# EAGLE schematic pcb_switch_switch (EAGLE 6.2)
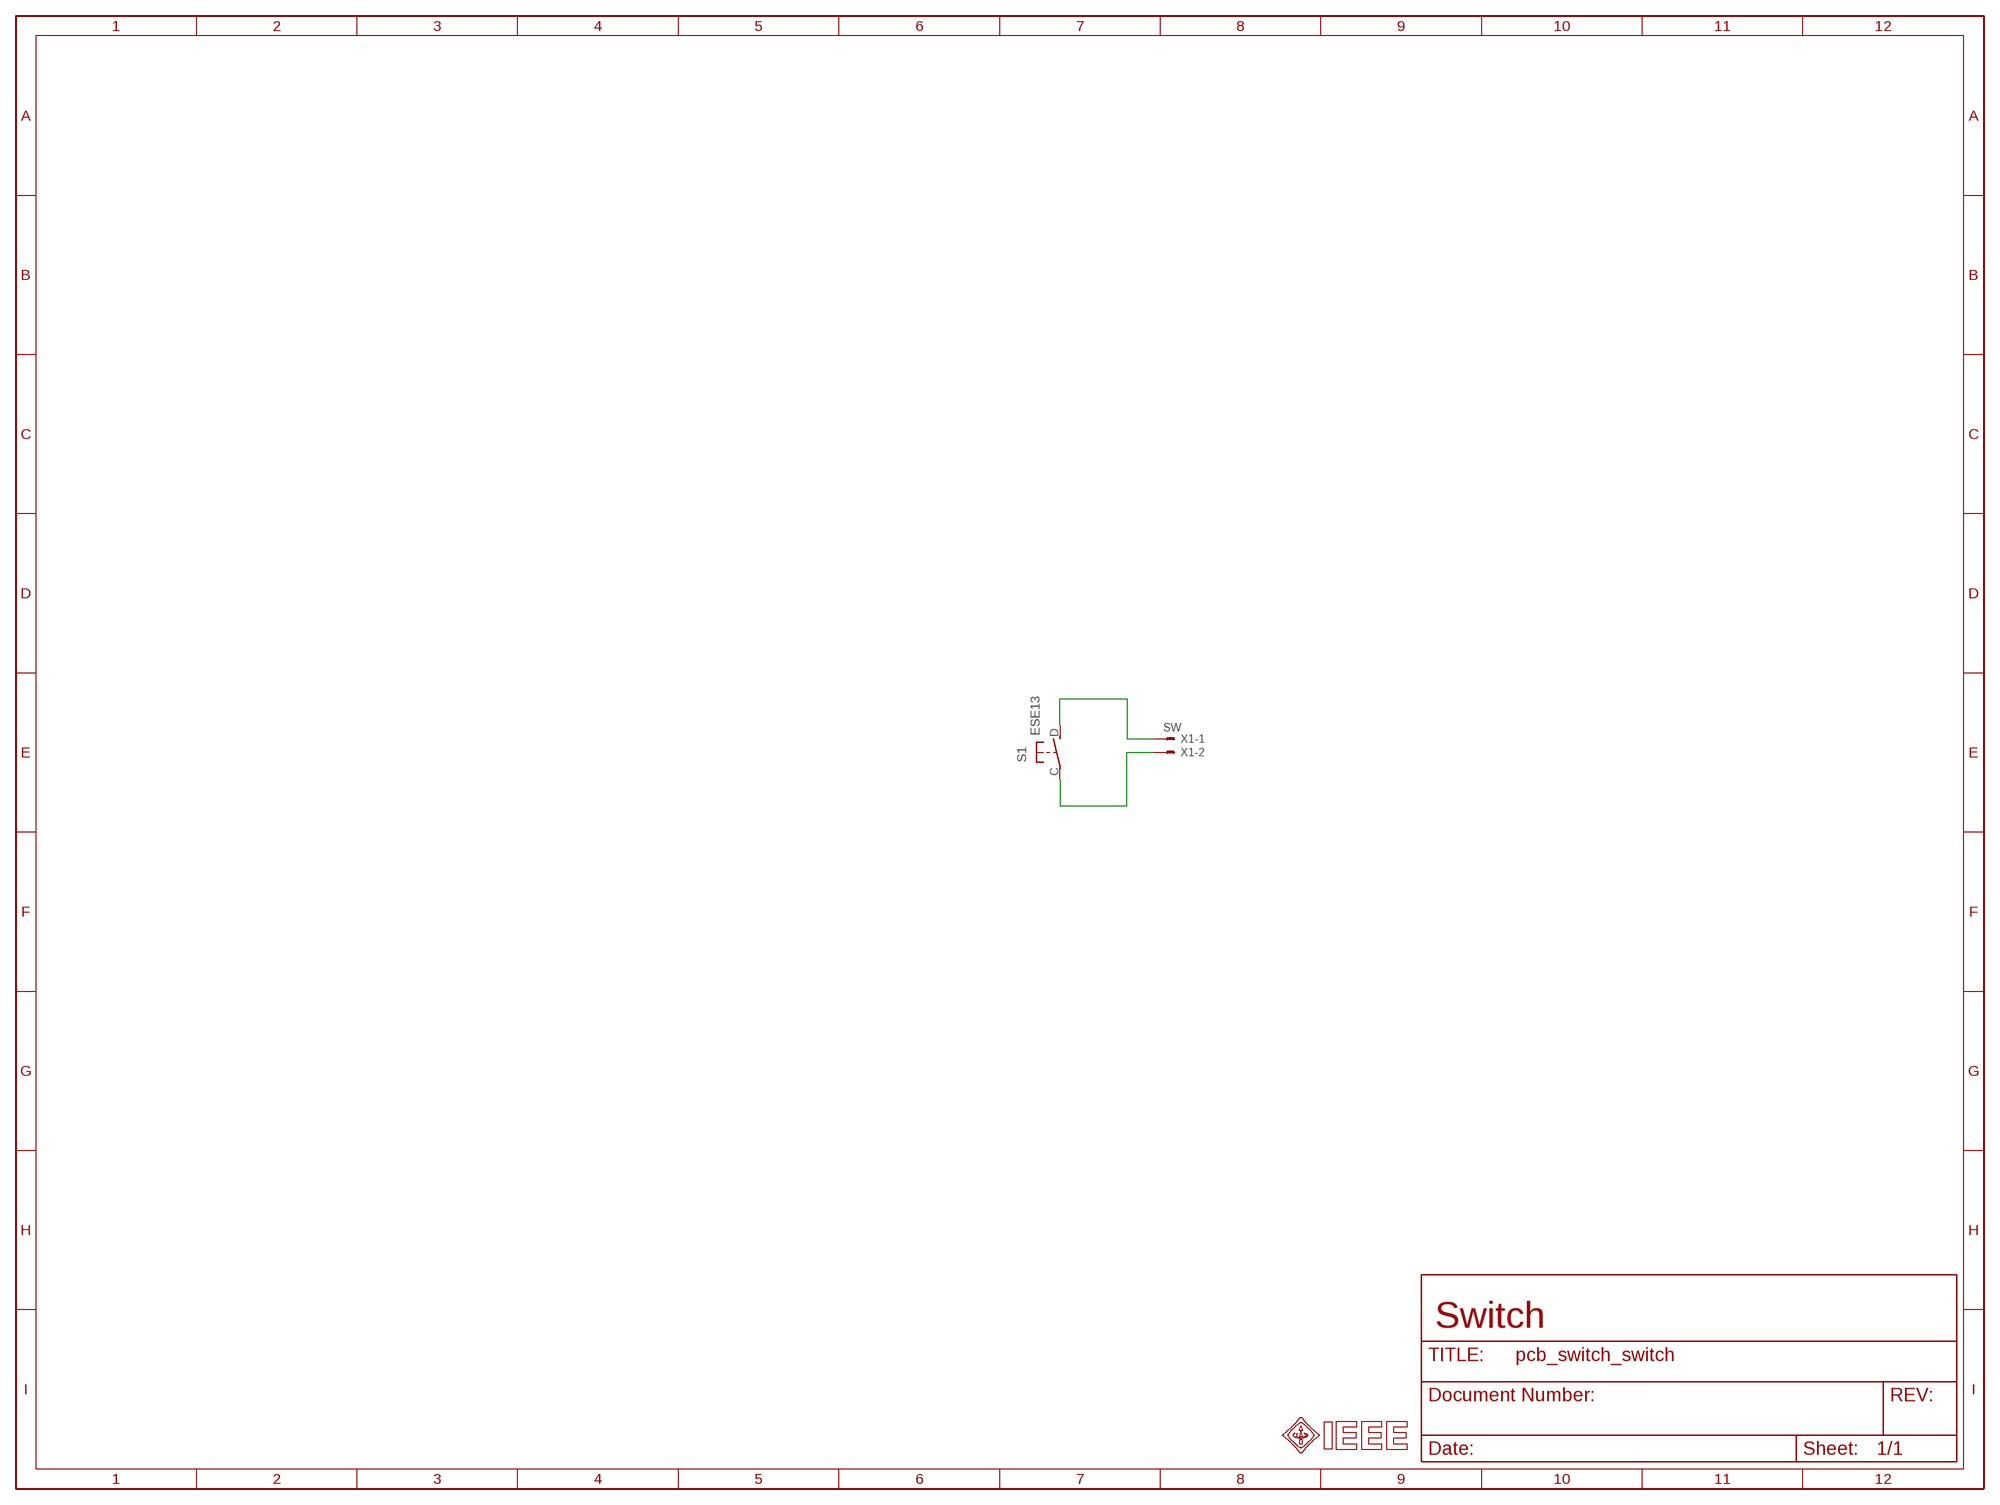
[diagram p0: schematic, sheet 1]

## Parts
S1  ESE13  [ESE13]
X1  SW  BM02B-SRSS-TB  [BM02B-SRSS-TB]

## Nets
N$1: S1.D(S) X1.1
N$2: S1.C(P) X1.2

## Notes on the sheet
- Switch

## Library data of the parts
S1 = switch-panasonic:ESE13
X1 = con-jst2:?M02B-SRSS-TB: Disconnectable Crimp style connector, 1.0mm pitch 2 contacts